# Altium project EPRTwinkie.PrjPcb
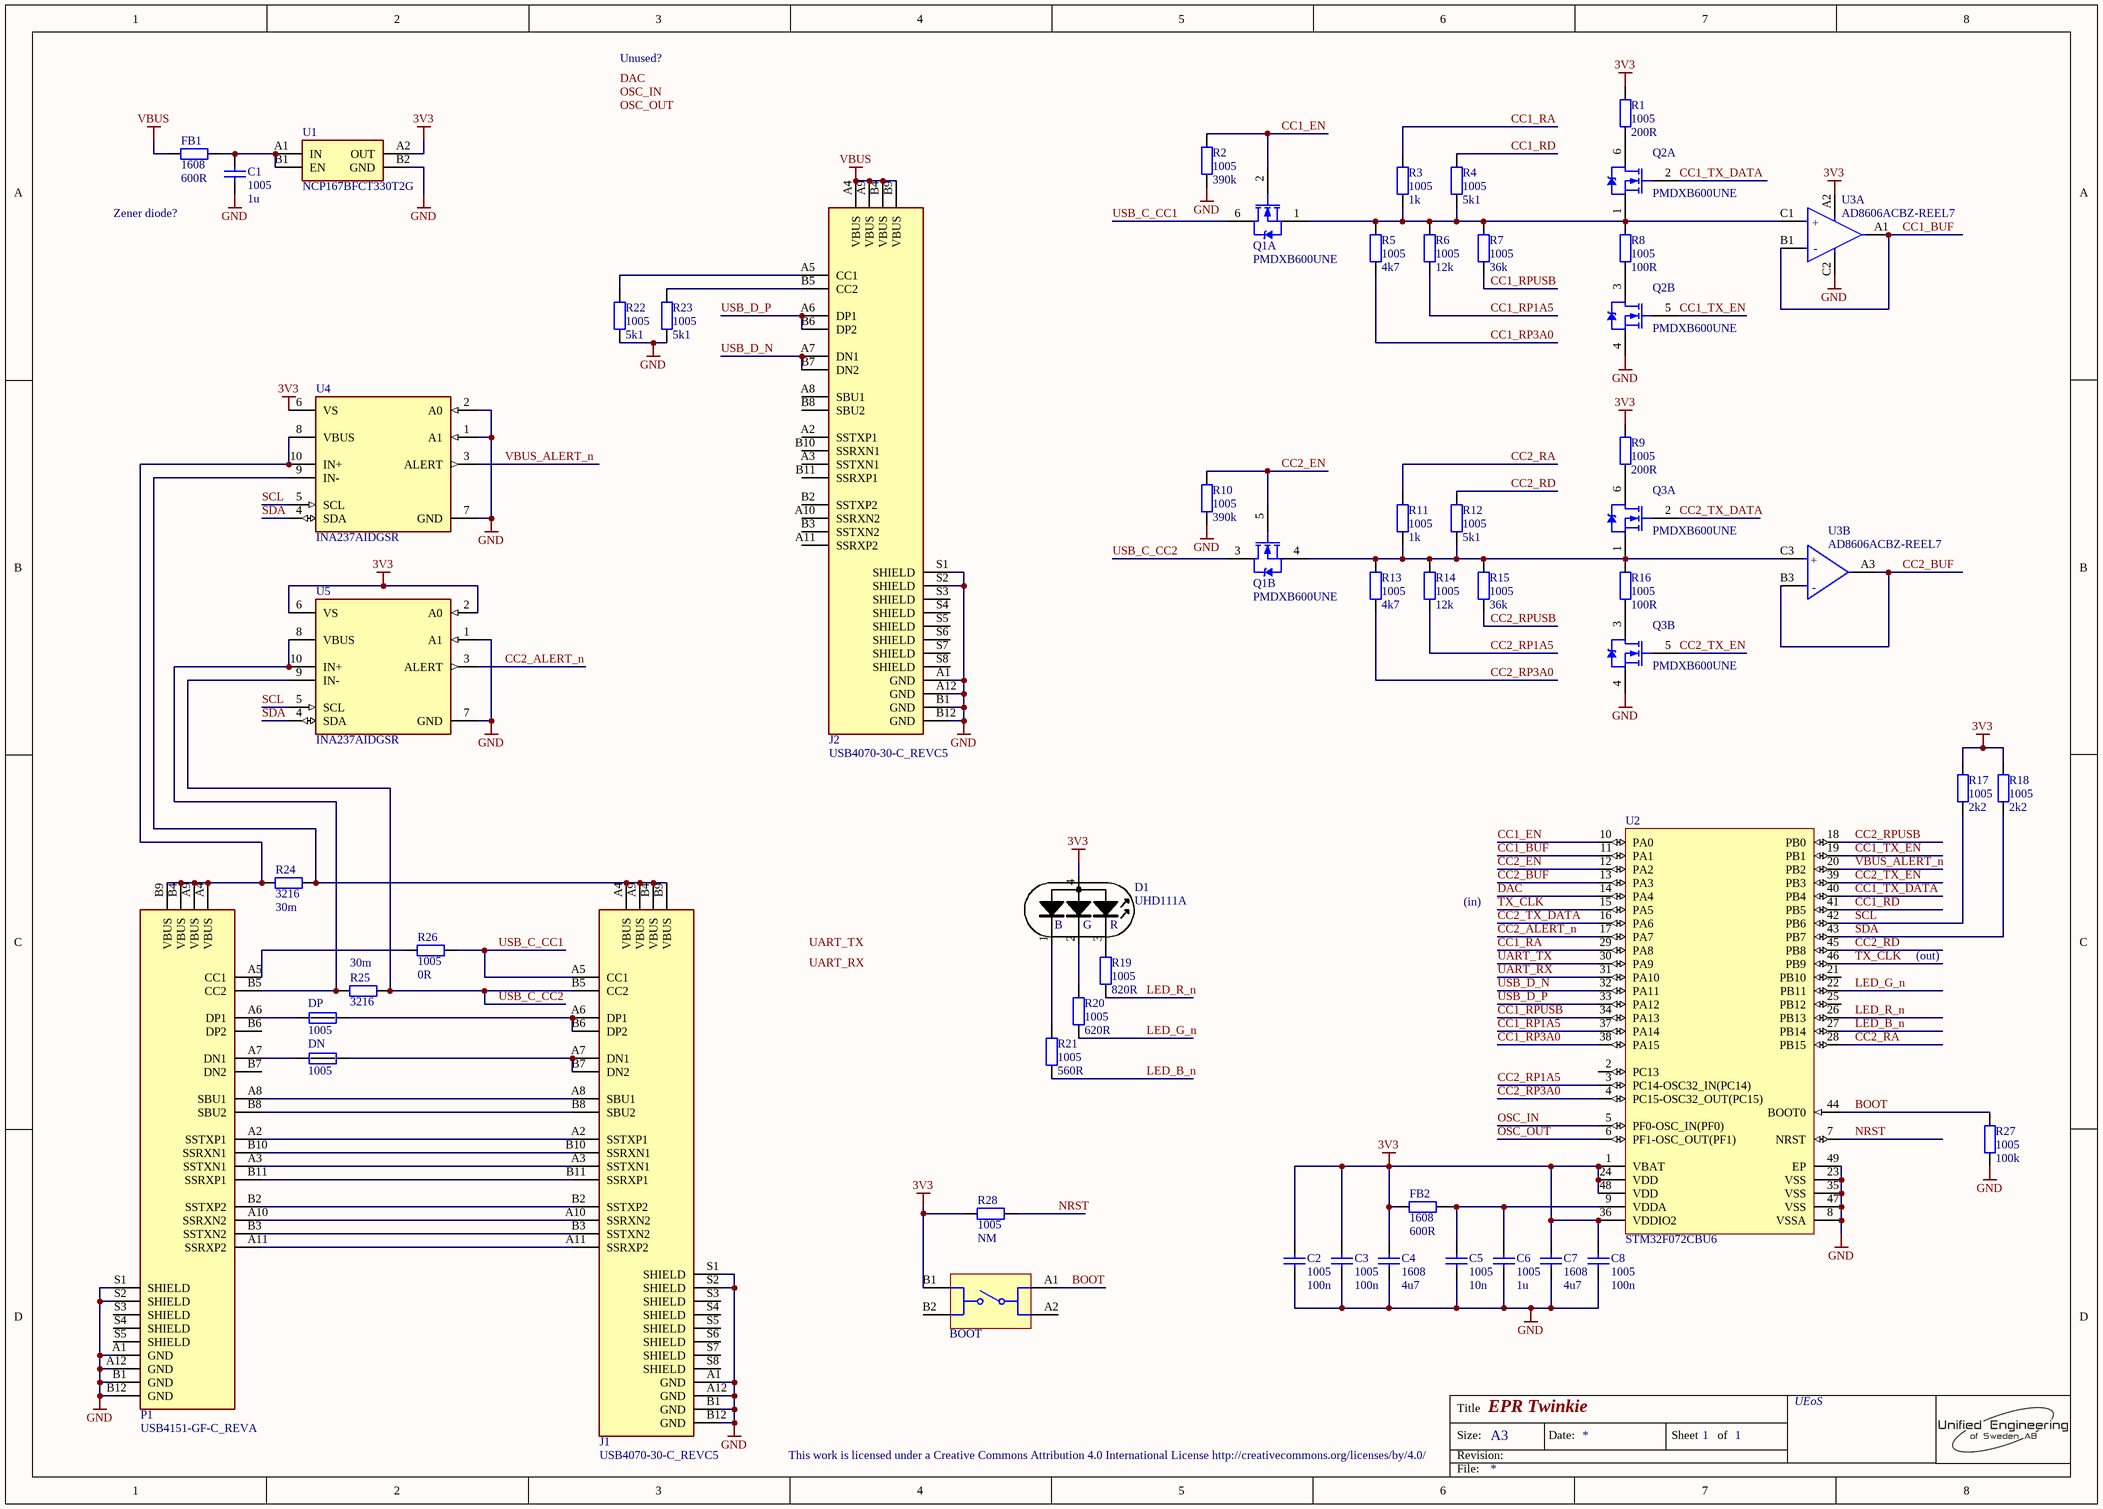
[diagram p0: EPRTwinkie.SchDoc]
1 sheet, 53 parts. Net scope: global (net labels, ports and power ports of the same name join across sheets).
Board file: EPRTwinkie.PcbDoc

## Sheet EPRTwinkie.SchDoc: EPR Twinkie
size A3; Organization: UEoS; SheetNumber: 1; SheetTotal: 1

### Parts
BOOT  434331013822  [434331013822]  (value not drawn)
C1  1005  value 1u  [CAPC1005]
C2  1005  value 100n  [CAPC1005]
C3  1005  value 100n  [CAPC1005]
C4  1608  value 4u7  [CAPC1608]
C5  1005  value 10n  [CAPC1005]
C6  1005  value 1u  [CAPC1005]
C7  1608  value 4u7  [CAPC1608]
C8  1005  value 100n  [CAPC1005]
D1  UHD111A  [Cree UHD111A]
DN  1005  [DogBone1005]  (net tie, no BOM)
DP  1005  [DogBone1005]  (net tie, no BOM)
FB1  1608  value 600R  [RESC1608]
FB2  1608  value 600R  [RESC1608]
J1  USB4070-30-C_REVC5  [GCT_USB4070-30-C_Straddle]
J2  USB4070-30-C_REVC5  [GCT_USB4070-30-C_Straddle]
P1  USB4151-GF-C_REVA  [GCT_USB4151-GF-C_STRADDLE]
Q1  PMDXB600UNE  [SON35P100X40-6N]  (parts A,B of 2)
Q2  PMDXB600UNE  [SON35P100X40-6N]  (parts A,B of 2)
Q3  PMDXB600UNE  [SON35P100X40-6N]  (parts A,B of 2)
R1  1005  value 200R  [RESC1005]
R2  1005  value 390k  [RESC1005]
R3  1005  value 1k  [RESC1005]
R4  1005  value 5k1  [RESC1005]
R5  1005  value 4k7  [RESC1005]
R6  1005  value 12k  [RESC1005]
R7  1005  value 36k  [RESC1005]
R8  1005  value 100R  [RESC1005]
R9  1005  value 200R  [RESC1005]
R10  1005  value 390k  [RESC1005]
R11  1005  value 1k  [RESC1005]
R12  1005  value 5k1  [RESC1005]
R13  1005  value 4k7  [RESC1005]
R14  1005  value 12k  [RESC1005]
R15  1005  value 36k  [RESC1005]
R16  1005  value 100R  [RESC1005]
R17  1005  value 2k2  [RESC1005]
R18  1005  value 2k2  [RESC1005]
R19  1005  value 820R  [RESC1005]
R20  1005  value 620R  [RESC1005]
R21  1005  value 560R  [RESC1005]
R22  1005  value 5k1  [RESC1005]
R23  1005  value 5k1  [RESC1005]
R24  3216  value 30m  [RESC3216]
R25  3216  value 30m  [RESC3216]
R26  1005  value 0R  [RESC1005]
R27  1005  value 100k  [RESC1005]
R28  1005  value NM  [RESC1005]
U1  NCP167BFCT330T2G  [BGA4C35P2X2_64X64X33]
U2  STM32F072CBU6  [STM-UFQFPN48_L]
U3  AD8606ACBZ-REEL7  [FP-CB-8-1-MFG]  (parts A,B of 2)
U4  INA237AIDGSR  [FP-DGS0010A-MFG]
U5  INA237AIDGSR  [FP-DGS0010A-MFG]

### Nets
3V3: BOOT.B1 C2.2 C3.2 C4.2 C7.2 C8.2 D1.4(C) FB2.2 R1.1 R9.1 R17.1 R18.2 R28.1 U1.A2(OUT) U2.1(VBAT) U2.24(VDD) U2.36(VDDIO2) U2.48(VDD) U3.A2(V+) U4.6(VS) U5.2(A0) U5.6(VS)
GND: C1.1 C2.1 C3.1 C4.1 C5.1 C6.1 C7.1 C8.1 J1.A1(GND) J1.A12(GND) J1.B1(GND) J1.B12(GND) J1.S1(SHIELD) J1.S2(SHIELD) J2.A1(GND) J2.A12(GND) J2.B1(GND) J2.B12(GND) J2.S1(SHIELD) J2.S2(SHIELD) P1.A1(GND) P1.A12(GND) P1.B1(GND) P1.B12(GND) P1.S1(SHIELD) P1.S2(SHIELD) Q2.4(S) Q3.4(S) R2.2 R10.2 R22.2 R23.2 R27.2 U1.B2(GND) U2.8(VSSA) U2.23(VSS) U2.35(VSS) U2.47(VSS) U2.49(EP) U3.C2(V-) U4.1(A1) U4.2(A0) U4.7(GND) U5.1(A1) U5.7(GND)
VBUS: FB1.2 J2.A4(VBUS) J2.A9(VBUS) J2.B4(VBUS) J2.B9(VBUS)
BOOT: BOOT.A1 R27.1 U2.44(BOOT0)
CC1_BUF: U2.11(PA1) U3.A1(OUTA) U3.B1(-INA)
CC1_EN: Q1.2(G) R2.1 U2.10(PA0)
CC1_RA: R3.1 U2.29(PA8)
CC1_RD: R4.1 U2.41(PB5)
CC1_RP1A5: R6.2 U2.37(PA14)
CC1_RP3A0: R5.2 U2.38(PA15)
CC1_RPUSB: R7.2 U2.34(PA13)
CC1_TX_DATA: Q2.2(G) U2.40(PB4)
CC1_TX_EN: Q2.5(G) U2.19(PB1)
CC2_ALERT_n: U2.17(PA7) U5.3(ALERT)
CC2_BUF: U2.13(PA3) U3.A3(OUTB) U3.B3(-INB)
CC2_EN: Q1.5(G) R10.1 U2.12(PA2)
CC2_RA: R11.1 U2.28(PB15)
CC2_RD: R12.1 U2.45(PB8)
CC2_RP1A5: R14.2 U2.3(PC14-OSC32_IN(PC14))
CC2_RP3A0: R13.2 U2.4(PC15-OSC32_OUT(PC15))
CC2_RPUSB: R15.2 U2.18(PB0)
CC2_TX_DATA: Q3.2(G) U2.16(PA6)
CC2_TX_EN: Q3.5(G) U2.39(PB3)
DAC: U2.14(PA4)
LED_B_n: R21.2 U2.27(PB14)
LED_G_n: R20.2 U2.22(PB11)
LED_R_n: R19.2 U2.26(PB13)
NRST: R28.2 U2.7(NRST)
OSC_IN: U2.5(PF0-OSC_IN(PF0))
OSC_OUT: U2.6(PF1-OSC_OUT(PF1))
SCL: R17.2 U2.42(PB6) U4.5(SCL) U5.5(SCL)
SDA: R18.1 U2.43(PB7) U4.4(SDA) U5.4(SDA)
TX_CLK: U2.15(PA5) U2.46(PB9)
UART_RX: U2.31(PA10)
UART_TX: U2.30(PA9)
USB_C_CC1: J1.A5(CC1) Q1.6(D) R26.2
USB_C_CC2: J1.B5(CC2) Q1.3(D) R25.2 U5.9(IN-)
USB_D_N: J2.A7(DN1) J2.B7(DN2) U2.32(PA11)
USB_D_P: J2.A6(DP1) J2.B6(DP2) U2.33(PA12)
VBUS_ALERT_n: U2.20(PB2) U4.3(ALERT)
NetC1_2: C1.2 FB1.1 U1.A1(IN) U1.B1(EN)
NetC5_2: C5.2 C6.2 FB2.1 U2.9(VDDA)
NetD1_1: D1.1 R21.1
NetD1_2: D1.2 R20.1
NetD1_3: D1.3 R19.1
NetDN_1: DN.1(Net1) P1.A7(DN1)
NetDN_2: DN.2(Net2) J1.A7(DN1) J1.B7(DN2)
NetDP_1: DP.1(Net1) P1.A6(DP1)
NetDP_2: DP.2(Net2) J1.A6(DP1) J1.B6(DP2)
NetJ1_A2: J1.A2(SSTXP1) P1.A2(SSTXP1)
NetJ1_A3: J1.A3(SSTXN1) P1.A3(SSTXN1)
NetJ1_A4: J1.A4(VBUS) J1.A9(VBUS) J1.B4(VBUS) J1.B9(VBUS) R24.2 U4.9(IN-)
NetJ1_A8: J1.A8(SBU1) P1.A8(SBU1)
NetJ1_A10: J1.A10(SSRXN2) P1.A10(SSRXN2)
NetJ1_A11: J1.A11(SSRXP2) P1.A11(SSRXP2)
NetJ1_B2: J1.B2(SSTXP2) P1.B2(SSTXP2)
NetJ1_B3: J1.B3(SSTXN2) P1.B3(SSTXN2)
NetJ1_B8: J1.B8(SBU2) P1.B8(SBU2)
NetJ1_B10: J1.B10(SSRXN1) P1.B10(SSRXN1)
NetJ1_B11: J1.B11(SSRXP1) P1.B11(SSRXP1)
NetJ2_A5: J2.A5(CC1) R22.1
NetJ2_B5: J2.B5(CC2) R23.1
NetP1_A4: P1.A4(VBUS) P1.A9(VBUS) P1.B4(VBUS) P1.B9(VBUS) R24.1 U4.8(VBUS) U4.10(IN+)
NetP1_A5: P1.A5(CC1) R26.1
NetP1_B5: P1.B5(CC2) R25.1 U5.8(VBUS) U5.10(IN+)
NetQ1_1: Q1.1(S) Q2.1(S) R3.2 R4.2 R5.1 R6.1 R7.1 R8.1 U3.C1(+INA)
NetQ1_4: Q1.4(S) Q3.1(S) R11.2 R12.2 R13.1 R14.1 R15.1 R16.1 U3.C3(+INB)
NetQ2_3: Q2.3(D) R8.2
NetQ2_6: Q2.6(D) R1.2
NetQ3_3: Q3.3(D) R16.2
NetQ3_6: Q3.6(D) R9.2

Not connected (* = marked no-connect by the designer): BOOT A2 B2; J1 S3(SHIELD) S4(SHIELD) S5(SHIELD) S6(SHIELD) S7(SHIELD) S8(SHIELD); J2 A2(SSTXP1) A3(SSTXN1) A8(SBU1) A10(SSRXN2) A11(SSRXP2) B2(SSTXP2) B3(SSTXN2) B8(SBU2) B10(SSRXN1) B11(SSRXP1) S3(SHIELD) S4(SHIELD) S5(SHIELD) S6(SHIELD) S7(SHIELD) S8(SHIELD); P1 B6(DP2) B7(DN2) S3(SHIELD) S4(SHIELD) S5(SHIELD); U2 2(PC13) 21(PB10) 25(PB12)

### Notes on the sheet
- Unused?
- Zener diode?
- (in)
- (out)
- This work is licensed under a Creative Commons Attribution 4.0 International License http://creativecommons.org/licenses/by/4.0/
- Labels drawn without touching a wire or pin: DAC, OSC_IN, OSC_OUT, UART_RX, UART_TX
- Title
- Size:
- Revision:
- A3
- Date:
- Sheet
- of
- File:
- (in symbol CMP-0384-00013-3, part A) +; -
- (in symbol CMP-0384-00013-3, part B) +; -
- (in symbol UHD111A_LED) B; G; R

### Library data of the parts
BOOT = 434331013822: WS-TASU SMT Tact Switch 3.5x2.9mm side push, SPST-NO, 12VDC, 50mA, 220g; Manufacturer: Wurth Elektronik; Washable: No; ComponentLink1Description: Website Link; ComponentLink1URL: https://www.we-online.com/redexpert/article/434331013822?ad; ComponentLink2Description: Datasheet Link; ComponentLink2URL: https://www.we-online.com/redexpert/spec/434331013822?ad; Manufacturer Part Number: 434331013822; Category: Tact Switches; Match Code: WS-TASU; Mount: Surface Mount; Operating Temperature Max: 85°C; Operating Temperature Min: -40°C; Packaging: Tape and Reel; Length: 3.5mm; Width: 2.9mm; Height: 1.35mm; Circuit: SPST-NO; Contact Material: Stainless Steel; Contact Plating: Silver; Operation Force: 220g; Rated Current: 50mA; Rated Voltage: 12VDC; Terminal Material: Copper Alloy; Terminal Plating: Silver
C1-C8 = Cap: Capacitor; Published: 8-Jun-2000; LatestRevisionDate: 17-Jul-2002; LatestRevisionNote: Re-released for DXP Platform.; PackageReference: RAD-0.3; Publisher: Altium Limited; PackageDescription: Radial Cap, Thru-Hole; 2 Leads; 0.3 in Pin Spacing
D1 = UHD111A_LED: LED RGB SMD
DN DP = DogBone1005
FB1 FB2 R1-R28 = Res2: Resistor; Published: 8-Jun-2000; LatestRevisionDate: 17-Jul-2002; LatestRevisionNote: Re-released for DXP Platform.; PackageReference: AXIAL-0.4; Publisher: Altium Limited; PackageDescription: Axial Device, Thru-Hole; 2 Leads; 0.4 in Pin Spacing
J1 J2 = USB4070-30-C_REVC5: USB-C (USB TYPE-C) USB 3.2 Gen 2 (USB 3.1 Gen 2, Superspeed + (USB 3.1)) Receptacle Connector 24 Position Surface Mount, Through Hole; MF: Global Connector Technology; Digi-Key_Part_Number: 2073-USB4070-30-CTR-ND; SnapEDA_Link: https://www.snapeda.com/parts/USB4070-30-C/Global+Connector+Technology/view-part/?ref=snap; Check_prices: https://www.snapeda.com/parts/USB4070-30-C/Global+Connector+Technology/view-part/?ref=eda; Package: None; MP: USB4070-30-C; Value: *; Purchase-URL: https://pricing.snapeda.com/search/part/USB4070-30-C/?ref=eda
P1 = USB4151-GF-C_REVA: USB Type C Plug, Vertical, SMT; Price: None; Package: None; Availability: Unavailable; MP: USB4151-GF-C_REVA; Value: *
Q1-Q3 = PMDXB600UNE: Dual N Channel Field Effect Transistor
U1 = NCP167BFCT330T2G: ON SEMICONDUCTOR - NCP167BFCT330T2G - LDO, FIXED, 3.3V, 0.7A, -40 TO 125DEG C; Manufacturer_Name: onsemi; Geometry.Height: 0.33mm; Manufacturer_Part_Number: NCP167BFCT330T2G; Mouser Part Number: 863-NCP167BFCT330T2G; Mouser Price/Stock: https://www.mouser.co.uk/ProductDetail/onsemi/NCP167BFCT330T2G?qs=l7cgNqFNU1gQH4CpPGF7lw%3D%3D; Arrow Part Number: NCP167BFCT330T2G; Arrow Price/Stock: https://www.arrow.com/en/products/ncp167bfct330t2g/on-semiconductor?region=nac; Datasheet Link: https://www.onsemi.com/pub/Collateral/NCP167-D.PDF
U2 = CMP-0304-00173-4: ARM Cortex-M0 32-bit MCU, 128 KB Flash, 16 KB Internal RAM, 37 I/Os, 48-Pin UFQFPN, -40 to 85 degC, Tray; Manufacturer: STMicroelectronics; I/Os (High Current): 37; FLASH Size (Prog) (kB): 128; Supply Voltage(Vcc) min (V): 2; Internal RAM Size (kB): 16; D/A Converter: 1; Operating Frequency(F) (Processor speed) (MHz): 48; Package Reference: UFQFPN48; ComponentLink2Description: Datasheet; ComponentLink2URL: http://www.st.com/st-web-ui/static/active/en/resource/technical/document/datasheet/DM00090510.pdf; Package Description: 48-Pin Ultra Thin Fine Pitch Quad Flat No-Lead, 7 x 7 x 0.6 mm Body, 0.5 mm Pitch, Exposed Pad; Mounting Technology: Surface Mount; Packing: Tray; ComponentLink1URL: http://www.st.com/; ComponentLink1Description: Manufacturer URL; DatasheetVersion: Rev. 5; PartNumber: STM32F072CBU6; Core: ARM Cortex-M0
U3 = CMP-0384-00013-3: IC OPAMP GP 2 CIRCUIT 8WLCSP; Common Mode Rejection Ratio: 85dB; Settling Time: 1us; Number of Amplifiers: 2; Unity Gain Bandwidth Product: 10MHz; Input Offset Voltage (Vos): 300uV; Input Voltage Noise Density: 8nV/sqrt Hz; Input Bias Current: 1pA; Input Capacitance: 8.8pF; Quiescent Current: 1.2mA; Max Supply Voltage: 5.5V; Slew Rate: 5V/µs; Amplifier Type: GENERAL PURPOSE; Voltage Gain: 120dB; Min Supply Voltage: 2.7V; Power Supply Rejection Ratio (PSRR): 95dB; Output Current per Channel: 80mA; Operating Supply Current: 2.4mA; Max Frequency: 1MHz; RoHS Compliant: Yes; Packaging: Tape and Reel; Number of Elements: 2; Number of Pins: 8; REACH SVHC: No SVHC; Number of Circuits: 2; Gain Bandwidth Product: 10MHz; Technology: CMOS; Bandwidth: 10MHz; Case/Package: BGA; Min Operating Temperature: -40°C; Series: DigiTrim®; Number of Channels: 2; Width: 1.825mm; Max Operating Temperature: 125°C; Lead Free: Contains Lead; Package Quantity: 3000; Contact Plating: Copper; Length: 1.48mm; Height: 0.38mm
U4 U5 = CMP-04895-000433-1: 85-V, 16-BIT, I2C OUTPUT CURRENT